# Altium schematic sheet CC2530-Module.SchDoc
size A4
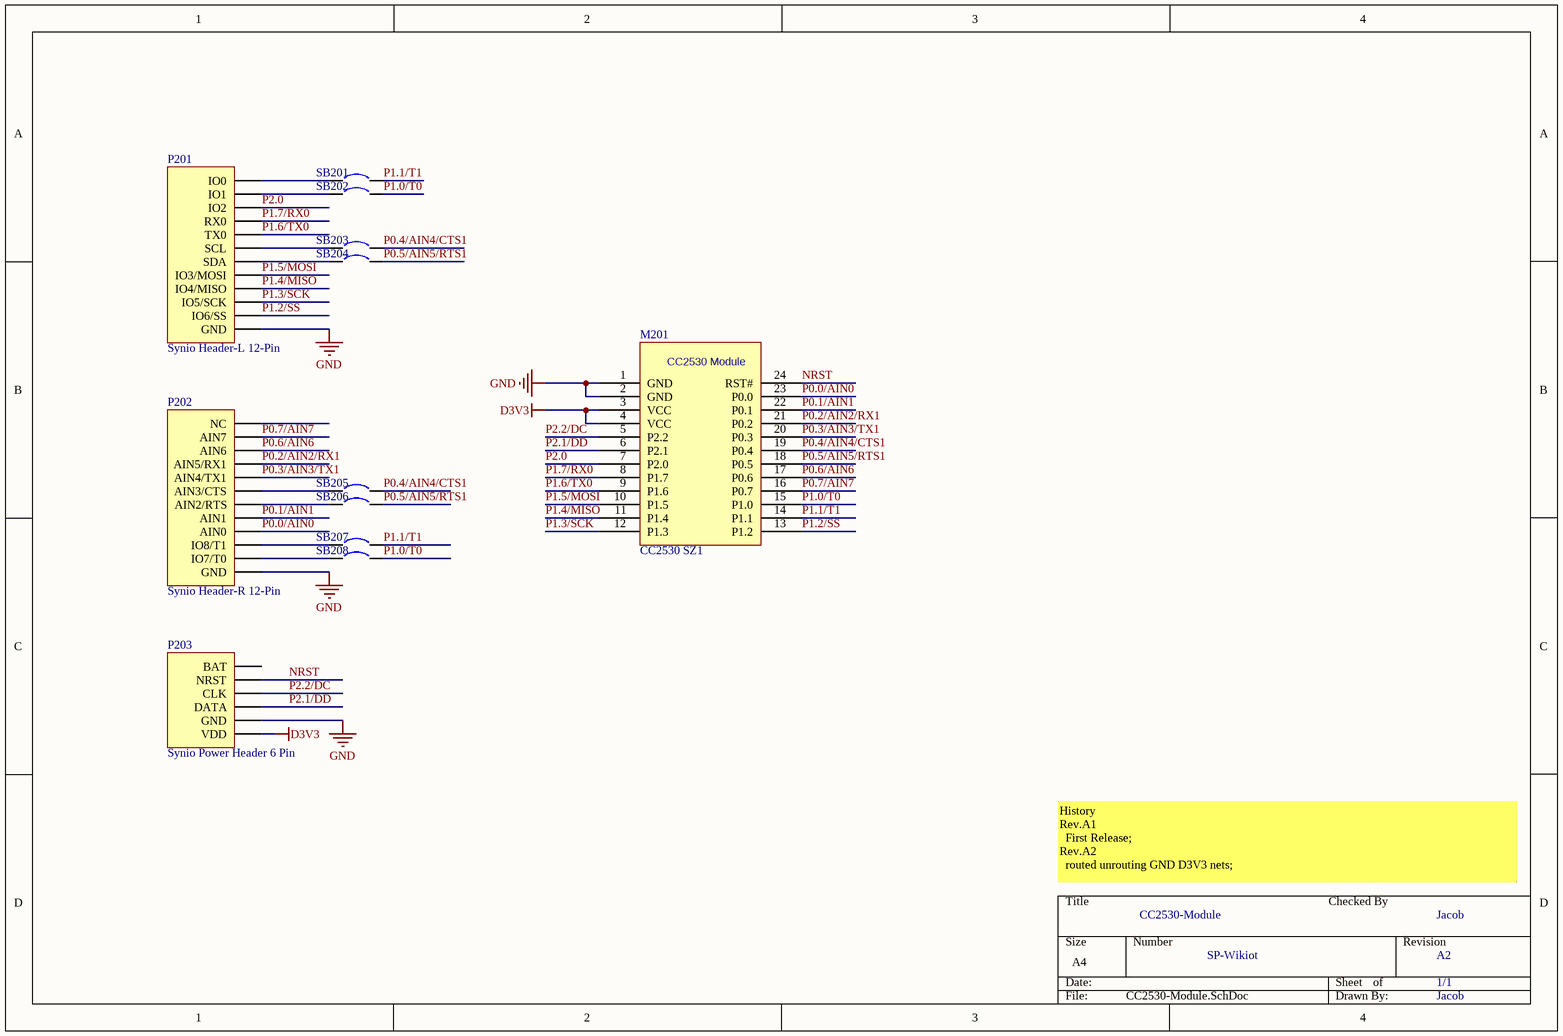
[diagram p0: CC2530-Module.SchDoc]

## Parts
M201  CC2530 SZ1  [CC2530-SMT]
P201  Synio Header-L 12-Pin  [HDR1X12]
P202  Synio Header-R 12-Pin  [HDR1X12]
P203  Synio Power Header 6 Pin  [HDR1X6/2.54MM]
SB201  Circuit Breaker  [JP2_SMD]  (value not drawn)
SB202  Circuit Breaker  [JP2_SMD]  (value not drawn)
SB203  Circuit Breaker  [JP2_SMD]  (value not drawn)
SB204  Circuit Breaker  [JP2_SMD]  (value not drawn)
SB205  Circuit Breaker  [JP2_SMD]  (value not drawn)
SB206  Circuit Breaker  [JP2_SMD]  (value not drawn)
SB207  Circuit Breaker  [JP2_SMD]  (value not drawn)
SB208  Circuit Breaker  [JP2_SMD]  (value not drawn)

## Nets
D3V3: M201.3(VCC) M201.4(VCC) P203.1(VDD)
GND: M201.1(GND) M201.2(GND) P201.1(GND) P202.1(GND) P203.2(GND)
NRST: M201.24(RST#) P203.5(NRST)
P0.0/AIN0: M201.23(P0.0) P202.4(AIN0)
P0.1/AIN1: M201.22(P0.1) P202.5(AIN1)
P0.2/AIN2/RX1: M201.21(P0.2) P202.9(AIN5/RX1)
P0.3/AIN3/TX1: M201.20(P0.3) P202.8(AIN4/TX1)
P0.4/AIN4/CTS1: M201.19(P0.4) SB203.2 SB205.2
P0.5/AIN5/RTS1: M201.18(P0.5) SB204.2 SB206.2
P0.6/AIN6: M201.17(P0.6) P202.10(AIN6)
P0.7/AIN7: M201.16(P0.7) P202.11(AIN7)
P1.0/T0: M201.15(P1.0) SB202.2 SB208.2
P1.1/T1: M201.14(P1.1) SB201.2 SB207.2
P1.2/SS: M201.13(P1.2) P201.2(IO6/SS)
P1.3/SCK: M201.12(P1.3) P201.3(IO5/SCK)
P1.4/MISO: M201.11(P1.4) P201.4(IO4/MISO)
P1.5/MOSI: M201.10(P1.5) P201.5(IO3/MOSI)
P1.6/TX0: M201.9(P1.6) P201.8(TX0)
P1.7/RX0: M201.8(P1.7) P201.9(RX0)
P2.0: M201.7(P2.0) P201.10(IO2)
P2.1/DD: M201.6(P2.1) P203.3(DATA)
P2.2/DC: M201.5(P2.2) P203.4(CLK)
NetP201_6: P201.6(SDA) SB204.1
NetP201_7: P201.7(SCL) SB203.1
NetP201_11: P201.11(IO1) SB202.1
NetP201_12: P201.12(IO0) SB201.1
NetP202_2: P202.2(IO7/T0) SB208.1
NetP202_3: P202.3(IO8/T1) SB207.1
NetP202_6: P202.6(AIN2/RTS) SB206.1
NetP202_7: P202.7(AIN3/CTS) SB205.1

Not connected (* = marked no-connect by the designer): P202 12(NC); P203 6(BAT)

## Notes on the sheet
- History
  Rev.A1
  First Release;
  Rev.A2
  routed unrouting GND D3V3 nets;
- CC2530-Module
- Checked By
- Jacob
- SP-Wikiot
- A2
- 1/1
- (in symbol CC2530 SZ1) CC2530 Module

## Library data of the parts
M201 = CC2530 SZ1: CC2530 SZ1 Module
P201 = Synio Header-L 12-Pin: Synio Header-L, 12-Pin; LatestRevisionDate: 17-Jul-2002; LatestRevisionNote: Re-released for DXP Platform.; Publisher: Altium Limited
P202 = Synio Header-R 12-Pin: Synio Header-R, 12-Pin; LatestRevisionDate: 17-Jul-2002; LatestRevisionNote: Re-released for DXP Platform.; Publisher: Altium Limited
SB201-SB208 = Circuit Breaker: Solder: YES; Published: 24-Mar-1999; Revision: July-2002: Re-released for DXP Platform.; Publisher: Altium Limited